# EAGLE design Board (EAGLE 9.1.1)
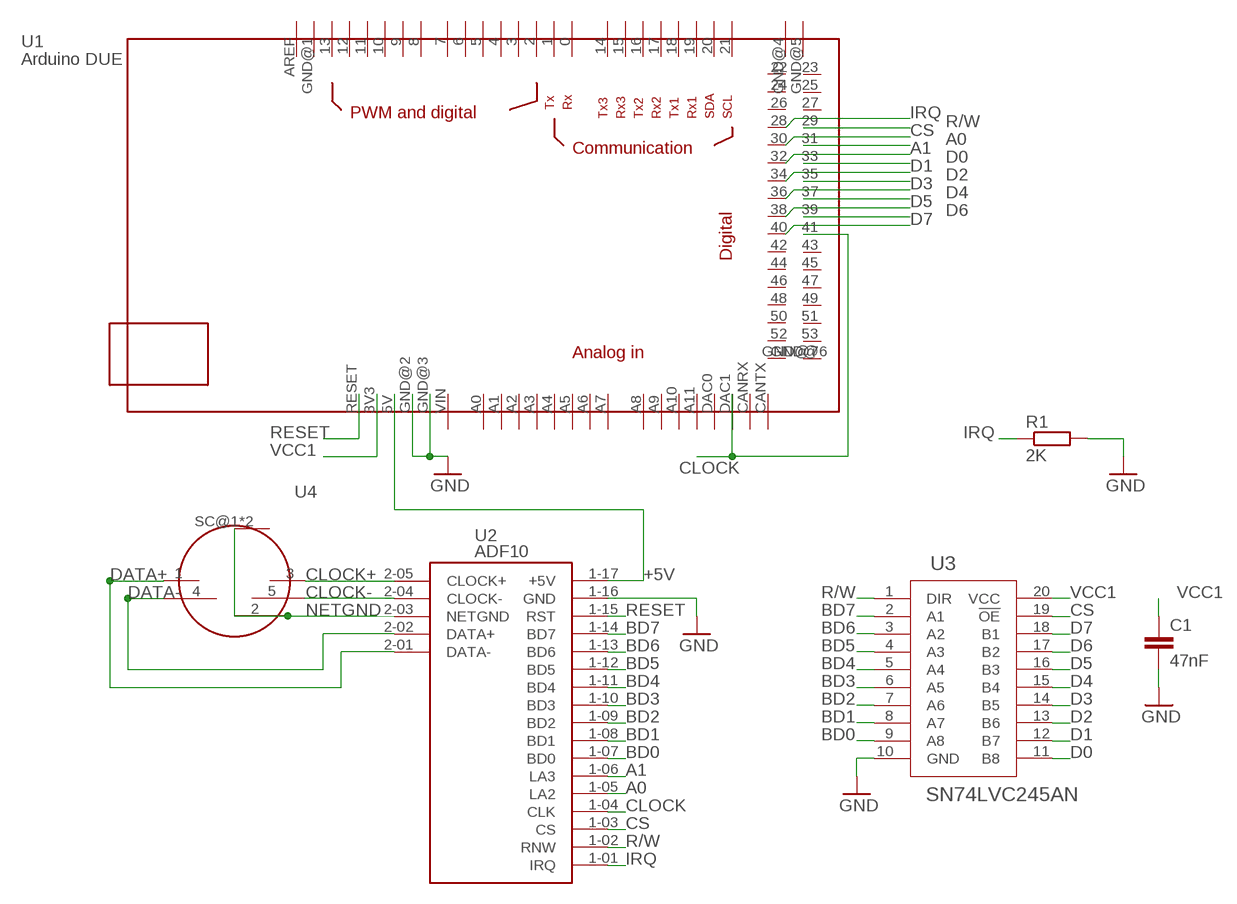
[diagram p0: schematic, sheet 1]

## Parts
C1  47nF  C-EU050-035X075  [C050-035X075]
R1  2K  R-EU_0309/12  [0309/12]
U1  ARDUINODUE  [MEGABOX]
U2  ADF10  [ADF10]
U3  SN74LVC245AN  [N20]
U4  491087  [491087]

## Nets
+5V: U1.5V U2.1-17(+5V)
A0: U1.31 U2.1-05(LA2)
A1: U1.32 U2.1-06(LA3)
BD0: U2.1-07(BD0) U3.9(A8)
BD1: U2.1-08(BD1) U3.8(A7)
BD2: U2.1-09(BD2) U3.7(A6)
BD3: U2.1-10(BD3) U3.6(A5)
BD4: U2.1-11(BD4) U3.5(A4)
BD5: U2.1-12(BD5) U3.4(A3)
BD6: U2.1-13(BD6) U3.3(A2)
BD7: U2.1-14(BD7) U3.2(A1)
CLOCK: U1.41 U1.DAC1 U2.1-04(CLK)
CLOCK+: U2.2-05(CLOCK+) U4.3
CLOCK-: U2.2-04(CLOCK-) U4.5
CS: U1.30 U2.1-03(CS) U3.19(!OE)
D0: U1.33 U3.11(B8)
D1: U1.34 U3.12(B7)
D2: U1.35 U3.13(B6)
D3: U1.36 U3.14(B5)
D4: U1.37 U3.15(B4)
D5: U1.38 U3.16(B3)
D6: U1.39 U3.17(B2)
D7: U1.40 U3.18(B1)
DATA+: U2.2-01(DATA-) U4.1
DATA-: U2.2-02(DATA+) U4.4
GND: C1.2 R1.2 U1.GND@2(GND) U1.GND@3(GND) U2.1-16(GND) U3.10(GND)
IRQ: R1.1 U1.28 U2.1-01(IRQ)
NETGND: U2.2-03(NETGND) U4.2 U4.SC@1(SHIELD) U4.SC@2(SHIELD)
R/W: U1.29 U2.1-02(RNW) U3.1(DIR)
RESET: U1.RESET U2.1-15(RST)
VCC1: C1.1 U1.3V3 U3.20(VCC)
Unconnected: U1.0 U1.1 U1.2 U1.3 U1.4 U1.5 U1.6 U1.7 U1.8 U1.9 U1.10 U1.11 U1.12 U1.13 U1.14 U1.15 U1.16 U1.17 U1.18 U1.19 U1.20 U1.21 U1.22 U1.23 U1.24 U1.25 U1.26 U1.27 U1.42 U1.43 U1.44 U1.45 U1.46 U1.47 U1.48 U1.49 U1.50 U1.51 U1.52 U1.53 U1.A0 U1.A1 U1.A2 U1.A3 U1.A4 U1.A5 U1.A6 U1.A7 U1.A8 U1.A9 U1.A10 U1.A11 U1.AREF U1.CANRX U1.CANTX U1.DAC0 U1.GND@1(GND) U1.GND@4(GND) U1.GND@5(GND) U1.GND@6(GND) U1.GND@7(GND) U1.VIN

## Library data of the parts
C1 = rcl:C-EU: CAPACITOR, European symbol; SPICEPREFIX: C
R1 = resistor:R-EU_: RESISTOR, European symbol
U1 = ArduinoSymbol:ARDUINODUE: mega card as device
U2 = AurduinoFilestoreParts:ADF10: Acorn ADF10 Econet Module Also applicable to AEH52 module
U3 = SN74LVC245A:SN74LVC245AN; MANUFACTURER_PART_NUMBER: SN74LVC245AN; VENDOR: Texas Instruments
U4 = SamacSys_Parts:491087

## Board
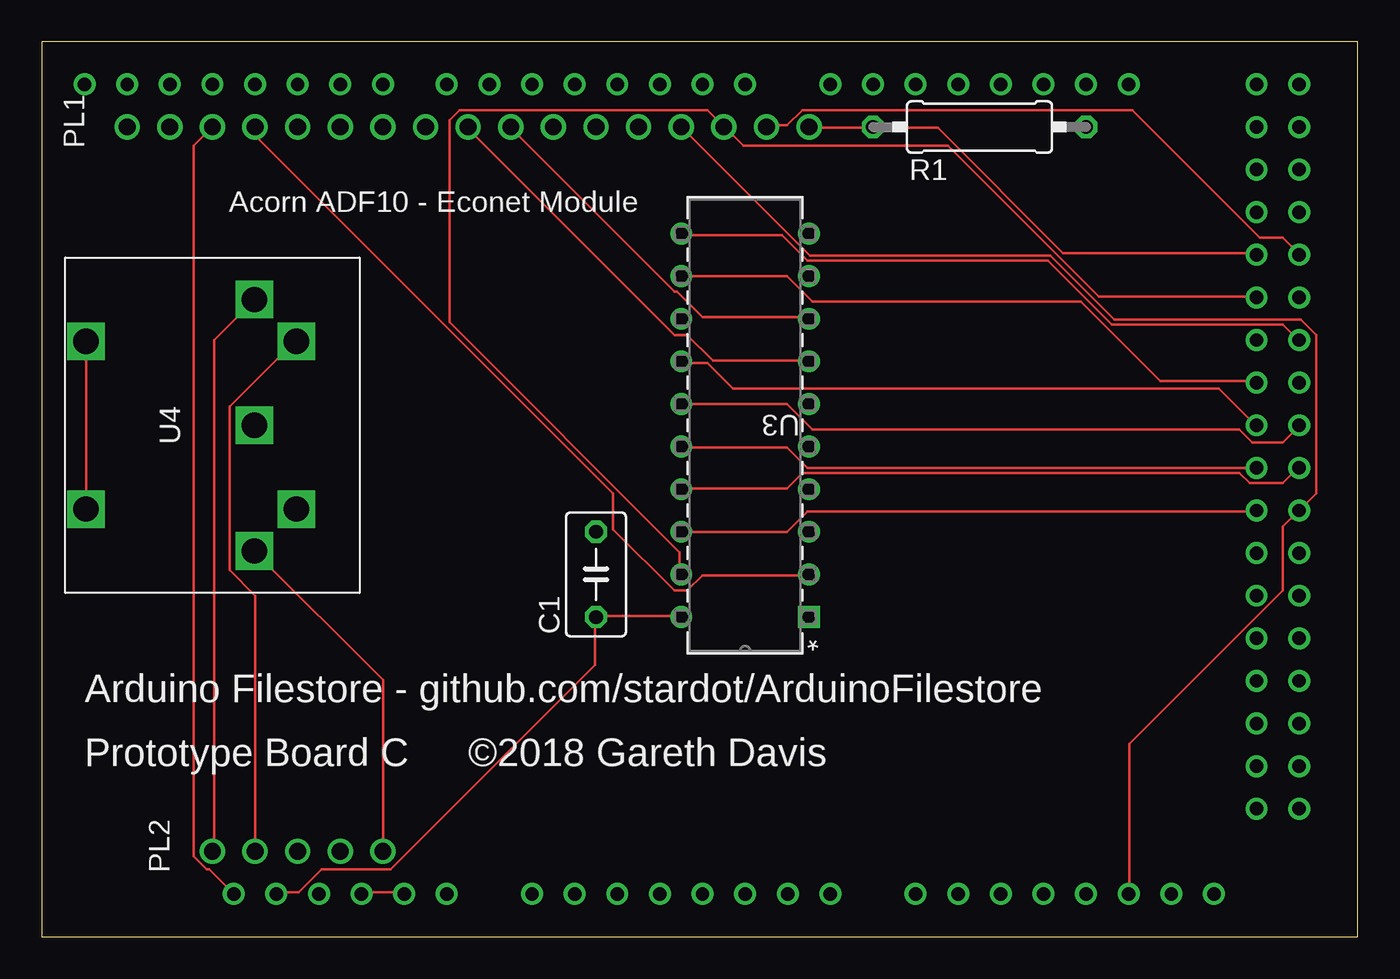
[diagram p1: board, top side]
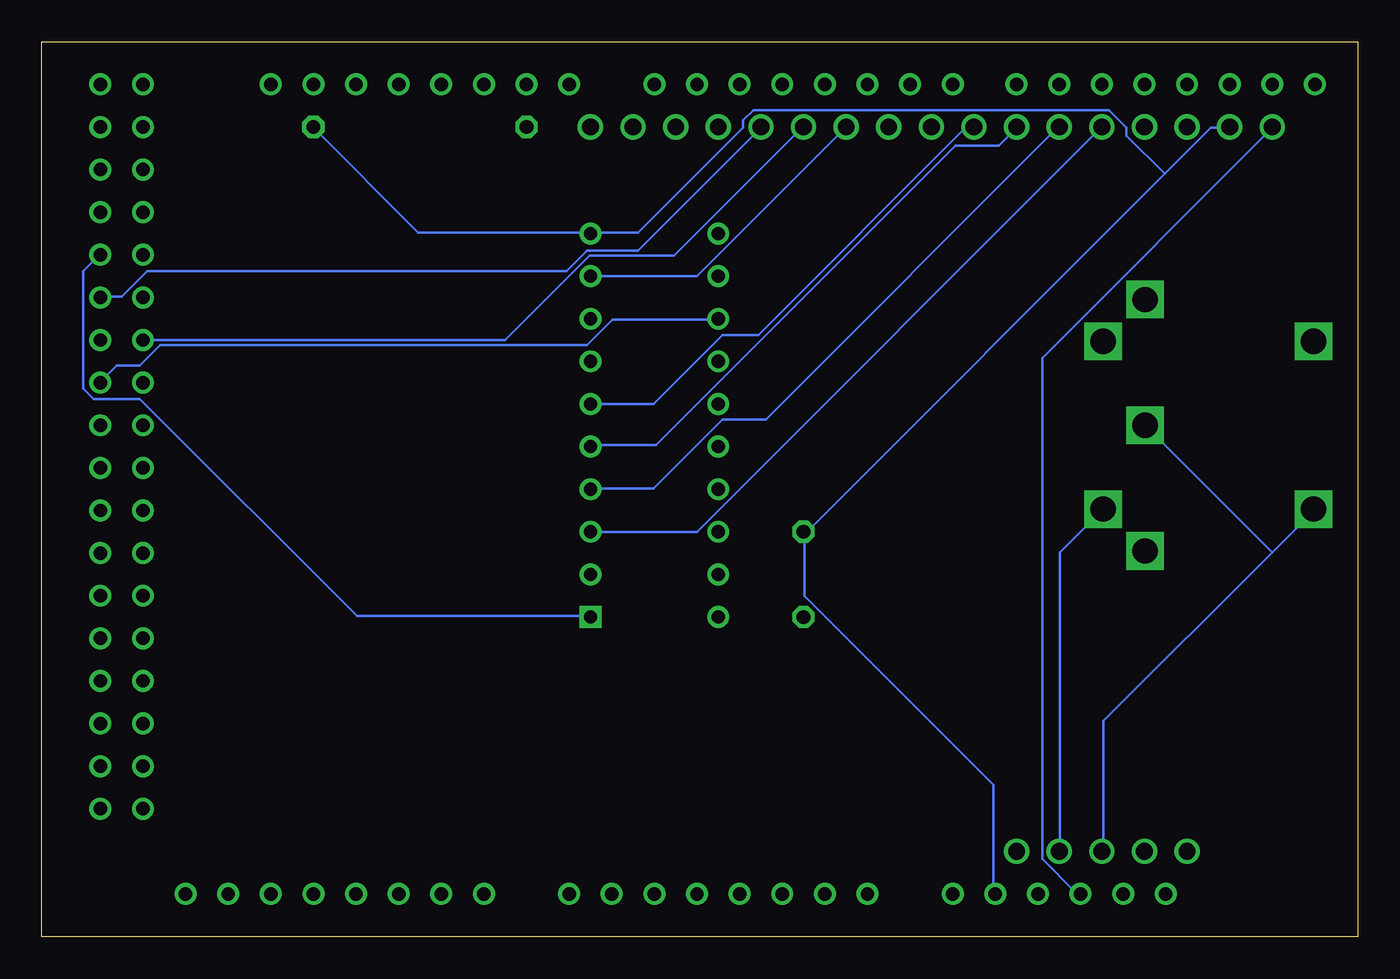
[diagram p2: board, bottom side, seen from below]

Size 78.41 x 53.33 mm. Coordinates in mm from the lower left corner, seen from the top.
Outline: 0,0 78.41,0 78.41,53.33 0,53.33 0,0
Copper layers (1*16): Top 0.035mm / dielectric 1.5mm / Bottom 0.035mm
Design rules "default": minimum track width 6mil, minimum drill 0.35mm, track to track 6mil, track to pad 6mil, pad to pad 6mil, via to via 6mil, smd to smd 6mil, copper to edge 40mil, drill to drill 6mil, minimum pad ring 10mil, minimum via ring 8mil, stop-mask expansion 4mil, vias tented up to drill 0mil, thermal gap 10mil

### Footprints (pad centres in the part's own frame; a part is rotated, then mirrored left to right if it is on the bottom)
C050-035X075 = drill 0.813 octagon: 1 -2.54,0; 2 2.54,0
0309/12 = drill 0.813 octagon: 1 -6.35,0; 2 6.35,0
MEGABOX = drill 0.8: 0 12.7,24.13; 1 10.16,24.13; 2 7.62,24.13; 3 5.08,24.13; 3V3 -15.24,-24.13; 4 2.54,24.13; 5 0,24.13; 5V -12.7,-24.13; 6 -2.54,24.13; 7 -5.08,24.13; 8 -8.89,24.13; 9 -11.43,24.13; 10 -13.97,24.13; 11 -16.51,24.13; 12 -19.05,24.13; 13 -21.59,24.13; 14 17.78,24.13; 15 20.32,24.13; 16 22.86,24.13; 17 25.4,24.13; 18 27.94,24.13; 19 30.48,24.13; 20 33.02,24.13; 21 35.56,24.13; 22 43.18,21.59; 23 45.72,21.59; 24 43.18,19.05; 25 45.72,19.05; 26 43.18,16.51; 27 45.72,16.51; 28 43.18,13.97; 29 45.72,13.97; 30 43.18,11.43; 31 45.72,11.43; 32 43.18,8.89; 33 45.72,8.89; 34 43.18,6.35; 35 45.72,6.35; 36 43.18,3.81; 37 45.72,3.81; 38 43.18,1.27; 39 45.72,1.27; 40 43.18,-1.27; 41 45.72,-1.27; 42 43.18,-3.81; 43 45.72,-3.81; 44 43.18,-6.35; 45 45.72,-6.35; 46 43.18,-8.89; 47 45.72,-8.89; 48 43.18,-11.43; 49 45.72,-11.43; 50 43.18,-13.97; 51 45.72,-13.97; 52 43.18,-16.51; 53 45.72,-16.51; A0 0,-24.13; A1 2.54,-24.13; A2 5.08,-24.13; A3 7.62,-24.13; A4 10.16,-24.13; A5 12.7,-24.13; A6 15.24,-24.13; A7 17.78,-24.13; A8 22.86,-24.13; A9 25.4,-24.13; A10 27.94,-24.13; A11 30.48,-24.13; AREF -26.67,24.13; CANRX 38.1,-24.13; CANTX 40.64,-24.13; DAC0 33.02,-24.13; DAC1 35.56,-24.13; GND@1 -24.13,24.13; GND@2 -10.16,-24.13; GND@3 -7.62,-24.13; GND@4 43.18,24.13; GND@5 45.72,24.13; GND@6 43.18,-19.05; GND@7 45.72,-19.05; RESET -17.78,-24.13; VIN -5.08,-24.13
ADF10 = drill 1: 1-01 22.86,-12.7; 1-02 22.86,-10.16; 1-03 22.86,-7.62; 1-04 22.86,-5.08; 1-05 22.86,-2.54; 1-06 22.86,0; 1-07 22.86,2.54; 1-08 22.86,5.08; 1-09 22.86,7.62; 1-10 22.86,10.16; 1-11 22.86,12.7; 1-12 22.86,15.24; 1-13 22.86,17.78; 1-14 22.86,20.32; 1-15 22.86,22.86; 1-16 22.86,25.4; 1-17 22.86,27.94; 2-01 -20.32,12.7; 2-02 -20.32,15.24; 2-03 -20.32,17.78; 2-04 -20.32,20.32; 2-05 -20.32,22.86
N20 = drill 0.787 pad 1.295 square: 1 -7.62,22.86 | drill 0.787 pad 1.295: 2 -7.62,20.32; 3 -7.62,17.78; 4 -7.62,15.24; 5 -7.62,12.7; 6 -7.62,10.16; 7 -7.62,7.62; 8 -7.62,5.08; 9 -7.62,2.54; 10 -7.62,0; 11 0,0; 12 0,2.54; 13 0,5.08; 14 0,7.62; 15 0,10.16; 16 0,12.7; 17 0,15.24; 18 0,17.78; 19 0,20.32; 20 0,22.86
491087 = drill 1.5 square: 1 2.5,-7.5; 2 2.5,0; 3 2.5,7.5; 4 5,-5; 5 5,5; SC@1 -7.54,5; SC@2 -7.54,-5

### Placement (x,y rotation side)
C1  33.02,21.59 90 top
R1  55.88,48.26 0 top
U1  29.21,26.67 0 top
U2  33.02,25.4 90 top
U3  38.1,41.91 180 top
U4  10.16,30.48 0 top

### Tracks (layer width: path | path; a pad name or v marks a point on that pad's centre or on a via)
+5V
  Bottom 0.152: U1.5V 16.51,2.64 16.82,2.64 18.8,4.62 18.8,34.49 5.08,48.21 U2.1-17
A0
  Bottom 0.152: U1.31 74.88,38.15 73.66,38.15 72.14,39.68 47.14,39.68 45.92,40.89 42.88,40.89 35.56,48.21 U2.1-05
A1
  Bottom 0.152: U1.32 72.29,35.56 50.8,35.56 45.77,40.59 40.74,40.59 33.12,48.21 U2.1-06
BD0
  Bottom 0.152: U3.9 45.62,39.37 39.37,39.37 30.53,48.21 U2.1-07
BD1
  Top 0.152: U3.8 45.62,36.93 39.37,36.93 37.85,38.46 37.69,38.46 27.94,48.21 U2.1-08
BD2
  Top 0.152: U3.7 45.62,34.34 39.98,34.34 38.46,35.87 37.69,35.87 25.35,48.21 U2.1-09
BD3
  Bottom 0.152: U3.6 45.62,31.75 41.96,31.75 37.85,35.87 35.71,35.87 23.37,48.21 22.91,48.21 U2.1-10
BD4
  Bottom 0.152: U3.5 45.62,29.31 41.81,29.31 23.98,47.14 21.39,47.14 20.32,48.21 U2.1-11
BD5
  Bottom 0.152: U3.4 45.62,26.72 41.96,26.72 37.85,30.84 35.25,30.84 17.88,48.21 U2.1-12
BD6
  Bottom 0.152: U3.3 45.62,24.13 39.37,24.13 15.29,48.21 U2.1-13
BD7
  Top 0.152: U3.2 45.62,21.54 39.37,21.54 38.46,20.62 37.69,20.62 34.04,24.28 34.04,26.42 12.7,47.75 12.7,48.21 U2.1-14
CLOCK
  Top 0.152: U1.DAC1 64.82,2.64 64.82,11.48 73.97,20.62 73.97,24.44 74.88,25.35 U1.41 75.03,25.5 75.95,26.42 75.95,35.87 75.03,36.78 63.91,36.78 60.1,40.59 45.77,40.59 38.15,48.21 U2.1-04
CLOCK+
  Top 0.152: U2.2-05 10.26,5.08 10.26,35.56 12.55,37.85 U4.3
CLOCK-
  Top 0.152: U2.2-04 12.7,20.32 11.18,21.84 11.18,31.6 15.14,35.56 U4.5
CS
  Top 0.152: U3.19 38,21.69 38,22.91 24.28,36.63 24.28,48.67 24.89,49.28 39.67,49.28 40.59,48.36 U2.1-03 40.74,48.21 41.81,47.14 54,47.14 62.99,38.15 72.29,38.15 U1.30
D0
  Top 0.152: U3.11 38.15,41.81 44.09,41.81 45.62,40.28 59.94,40.28 63.75,36.47 73.97,36.47 74.88,35.56 U1.33
D1
  Top 0.152: U3.12 38.15,39.37 44.4,39.37 45.92,37.85 61.92,37.85 66.65,33.12 72.29,33.12 U1.34
D2
  Bottom 0.152: U3.13 38.15,36.78 44.4,36.78 45.92,35.26 71.37,35.26 72.59,34.04 73.97,34.04 74.88,33.12 U1.35
D3
  Top 0.152: U3.14 38.15,34.19 39.67,34.19 41.2,32.66 70.16,32.66 72.29,30.53 U1.36
D4
  Top 0.152: U3.15 38.15,31.75 44.4,31.75 45.92,30.23 71.37,30.23 72.14,29.46 73.97,29.46 74.88,30.38 U1.37
D5
  Top 0.152: U3.16 38.15,29.16 44.4,29.16 45.62,27.94 72.29,27.94 U1.38
D6
  Top 0.152: U3.17 38.15,26.72 44.4,26.72 45.31,27.63 71.37,27.63 71.98,27.03 73.97,27.03 74.88,27.94 U1.39
D7
  Top 0.152: U3.18 38.15,24.13 44.4,24.13 45.62,25.35 72.29,25.35 U1.40
DATA+
  Top 0.152: U2.2-01 20.32,15.29 12.7,22.91 U4.1
DATA-
  Bottom 0.152: U2.2-02 17.73,5.08 17.73,22.91 15.29,25.35 U4.4
GND
  Top 0.152: U1.GND@2 19.1,2.64 21.54,2.64 U1.GND@3
  Bottom 0.152: R1.2 62.23,48.21 55.98,41.96 45.77,41.96 U3.10 45.62,41.96 42.88,41.96 36.63,48.21 36.63,48.67 36.02,49.28 14.83,49.28 13.77,48.21 13.77,47.75 11.48,45.47 | 32.97,23.98 32.97,20.32 21.69,9.04 21.69,2.64 U1.GND@3 | 32.97,23.98 32.97,24.13 C1.2 32.97,23.98 | 32.97,23.98 11.48,45.47 | 11.48,45.47 8.74,48.21 7.67,48.21 U2.1-16
IRQ
  Top 0.152: U1.28 72.29,40.74 60.86,40.74 53.39,48.21 49.58,48.21 R1.1 49.43,48.21 45.77,48.21 U2.1-01
NETGND
  Top 0.152: U4.SC@1 2.64,35.41 2.64,25.5 U4.SC@2
  Bottom 0.152: 5.08,22.91 2.64,25.35 U4.SC@2 | 5.08,22.91 15.14,12.85 15.14,5.08 U2.2-03 | 5.08,22.91 12.55,30.38 U4.2
R/W
  Top 0.152: U2.1-02 43.18,48.36 44.4,48.36 45.31,49.28 64.97,49.28 72.59,41.66 73.97,41.66 74.88,40.74 U1.29
  Bottom 0.152: U3.1 45.77,19.1 59.64,19.1 72.59,32.05 75.34,32.05 75.95,32.66 75.95,39.68 75.03,40.59 U1.29
RESET
  Top 0.152: U1.RESET 11.33,2.64 9.96,4.01 9.8,4.01 9.04,4.78 9.04,47.14 10.11,48.21 U2.1-15
VCC1
  Top 0.152: U3.20 38,19.1 33.12,19.1 C1.1 32.97,18.95 32.97,16.2 20.78,4.01 16.66,4.01 15.29,2.64 14.07,2.64 U1.3V3

### Text on the board
tPlace: Arduino Filestore - github.com/stardot/ArduinoFilestore | Prototype Board C | ©2018 Gareth Davis